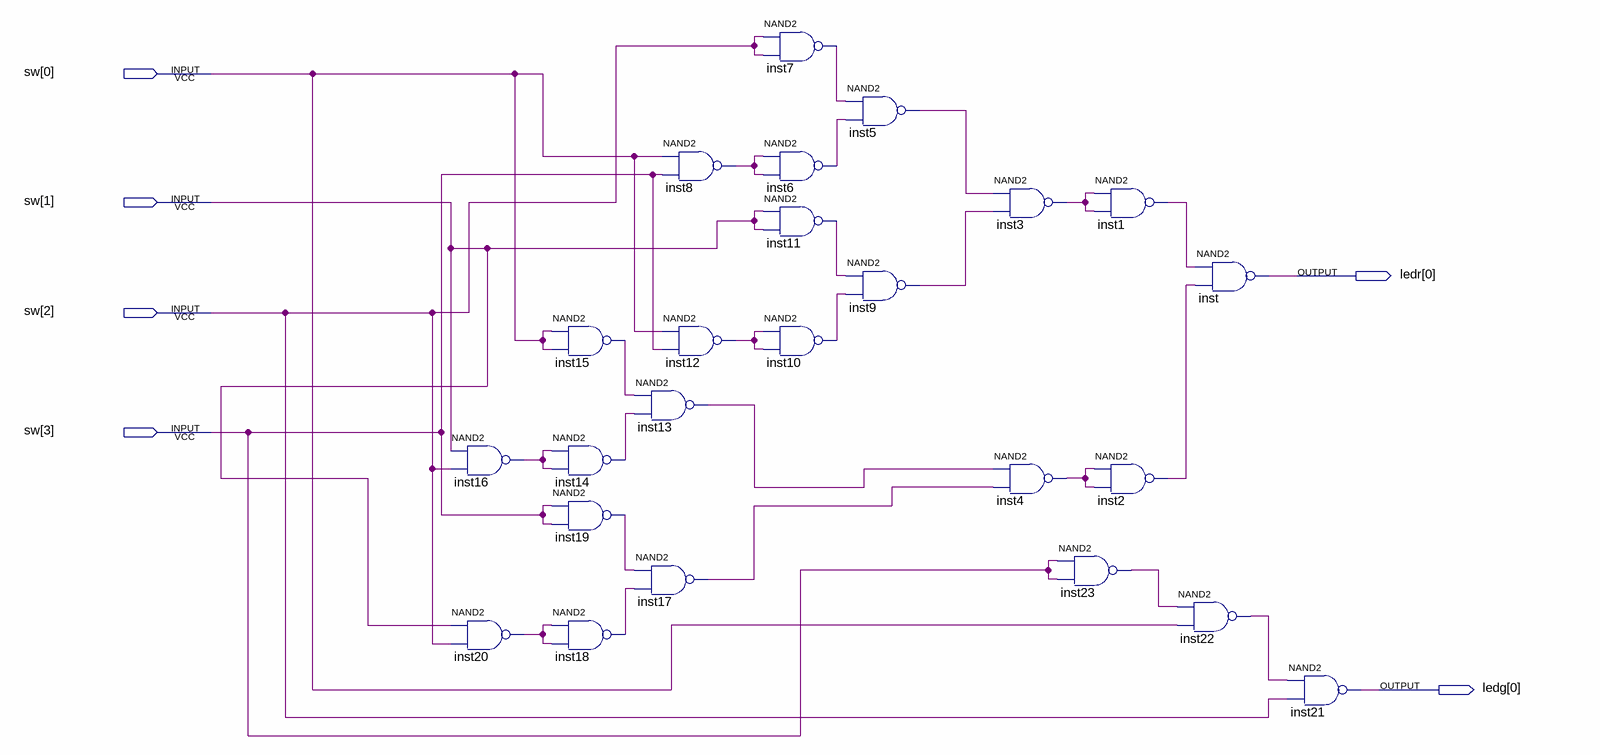
[diagram p0: schematic sheet]
// Quartus schematic Lab3_NAND.bdf as structural Verilog: 24 symbols, 6 pins
module Lab3_NAND (
  input  [3:0] sw,
  output [0:0] ledr,
  output [0:0] ledg
);

  wire inst1_out, inst2_out, inst3_out, inst4_out, inst5_out, inst6_out, inst7_out, inst8_out, inst9_out,
       inst10_out, inst11_out, inst12_out, inst13_out, inst14_out, inst15_out, inst16_out, inst17_out,
       inst18_out, inst19_out, inst20_out, inst22_out, inst23_out;

  nand inst16 (inst16_out, sw[1], sw[2]);
  nand inst20 (inst20_out, sw[1], sw[2]);
  nand inst15 (inst15_out, sw[0], sw[0]);
  nand inst14 (inst14_out, inst16_out, inst16_out);
  nand inst19 (inst19_out, sw[3], sw[3]);
  nand inst18 (inst18_out, inst20_out, inst20_out);
  nand inst8 (inst8_out, sw[0], sw[3]);
  nand inst12 (inst12_out, sw[0], sw[3]);
  nand inst13 (inst13_out, inst15_out, inst14_out);
  nand inst17 (inst17_out, inst19_out, inst18_out);
  nand inst7 (inst7_out, sw[2], sw[2]);
  nand inst6 (inst6_out, inst8_out, inst8_out);
  nand inst11 (inst11_out, sw[1], sw[1]);
  nand inst10 (inst10_out, inst12_out, inst12_out);
  nand inst5 (inst5_out, inst7_out, inst6_out);
  nand inst9 (inst9_out, inst11_out, inst10_out);
  nand inst3 (inst3_out, inst5_out, inst9_out);
  nand inst4 (inst4_out, inst13_out, inst17_out);
  nand inst23 (inst23_out, sw[3], sw[3]);
  nand inst1 (inst1_out, inst3_out, inst3_out);
  nand inst2 (inst2_out, inst4_out, inst4_out);
  nand inst (ledr[0], inst1_out, inst2_out);
  nand inst22 (inst22_out, inst23_out, sw[0]);
  nand inst21 (ledg[0], inst22_out, sw[2]);
endmodule
